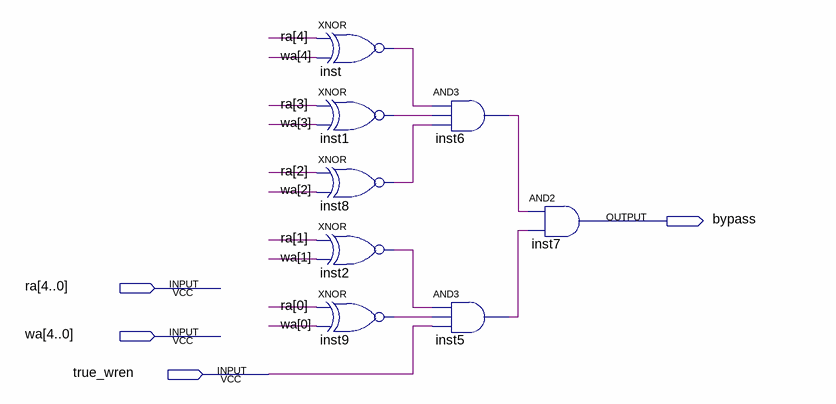
[diagram p0: schematic sheet]
// Quartus schematic regCmp.bdf as structural Verilog: 8 symbols, 4 pins
module regCmp (
  input  [4:0] ra,
  input  [4:0] wa,
  input  true_wren,
  output bypass
);

  wire inst1_out, inst2_out, inst5_out, inst6_out, inst8_out, inst9_out, inst_out;

  xnor inst (inst_out, ra[4], wa[4]);
  xnor inst1 (inst1_out, ra[3], wa[3]);
  xnor inst8 (inst8_out, ra[2], wa[2]);
  xnor inst2 (inst2_out, ra[1], wa[1]);
  xnor inst9 (inst9_out, ra[0], wa[0]);
  and inst6 (inst6_out, inst_out, inst1_out, inst8_out);
  and inst5 (inst5_out, inst2_out, inst9_out, true_wren);
  and inst7 (bypass, inst6_out, inst5_out);
endmodule
